# Altium project QSTL_LED_PCB.PrjPcb
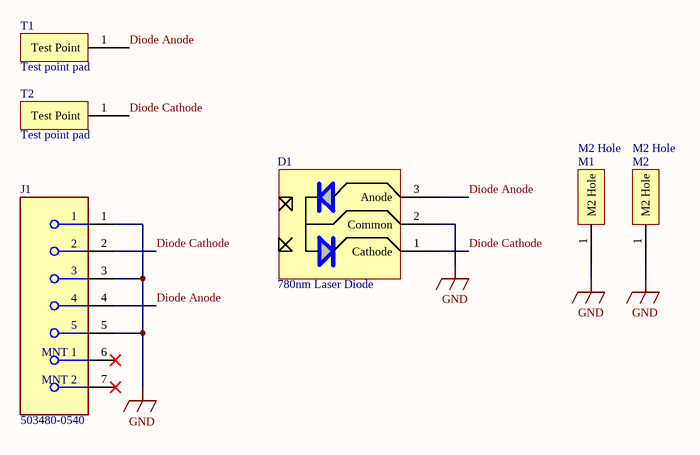
[diagram p0: QSTL_LED_PCB.SchDoc]
1 sheet, 6 parts. Net scope: global (net labels, ports and power ports of the same name join across sheets).
Board file: QSTL_LED_PCB.PcbDoc

## Sheet QSTL_LED_PCB.SchDoc: QSTL LED PCB
size A4; Author: Jeonghyun Park; CompanyName: QSTL; DrawnBy: Jeonghyun Park; DocumentNumber: 1; Revision: 1.0; SheetNumber: 1; SheetTotal: 1

### Parts
D1  780nm Laser Diode  [D7805I]
J1  503480-0540  [FP-503480-0540-MFG]
M1  M2 Hole  [M2]
M2  M2 Hole  [M2]
T1  Test point pad  [Test_Point_Pin]
T2  Test point pad  [Test_Point_Pin]

### Nets
GND: D1.2(Common) J1.1 J1.3 J1.5 M1.1(M2_Hole) M2.1(M2_Hole)
Diode Anode: D1.3(Anode) J1.4 T1.1(Test_Point)
Diode Cathode: D1.1(Cathode) J1.2 T2.1(Test_Point)

Not connected (* = marked no-connect by the designer): J1 6(MNT_1)* 7(MNT_2)*

### Library data of the parts
D1 = D7805I
J1 = CMP-00257-52963780-1: 503480-0540 Connector FFC/FPC SKT 5 Position 0.5mm Solder Right Angle Surface Mount T/R; Manufacturer Lifecycle Status: ACTIVE; Actuator Material: Glass, Nylon, Polyamide; Number of Positions: 5; Pitch: 508µm; Plating: Gold; Voltage Rating: 50V; Current Rating: 500mA; Wire/Cable Type: Straight; Contact Plating: Gold; Termination: Solder; Country of Origin: KR; Number of Rows: 1; RoHS: Compliant; NexarPartId: 52963780; Max Operating Temperature: 85°C; Lifecycle Status: Production; Mount: Surface Mount; Halogen Free: Low Halogen; Height: 2.07mm; Housing Material: Polymer; Number of Circuits: 5; Number of Contacts: 5; Min Operating Temperature: -40°C; Flammability Rating: UL94 V-0; Contact Material: Bronze, Gold, Nickel; Orientation: Right Angle
M1 M2 = M2
T1 T2 = Test_Point_Pin